# Altium schematic sheet mainMARLIN.SchDoc
size A3
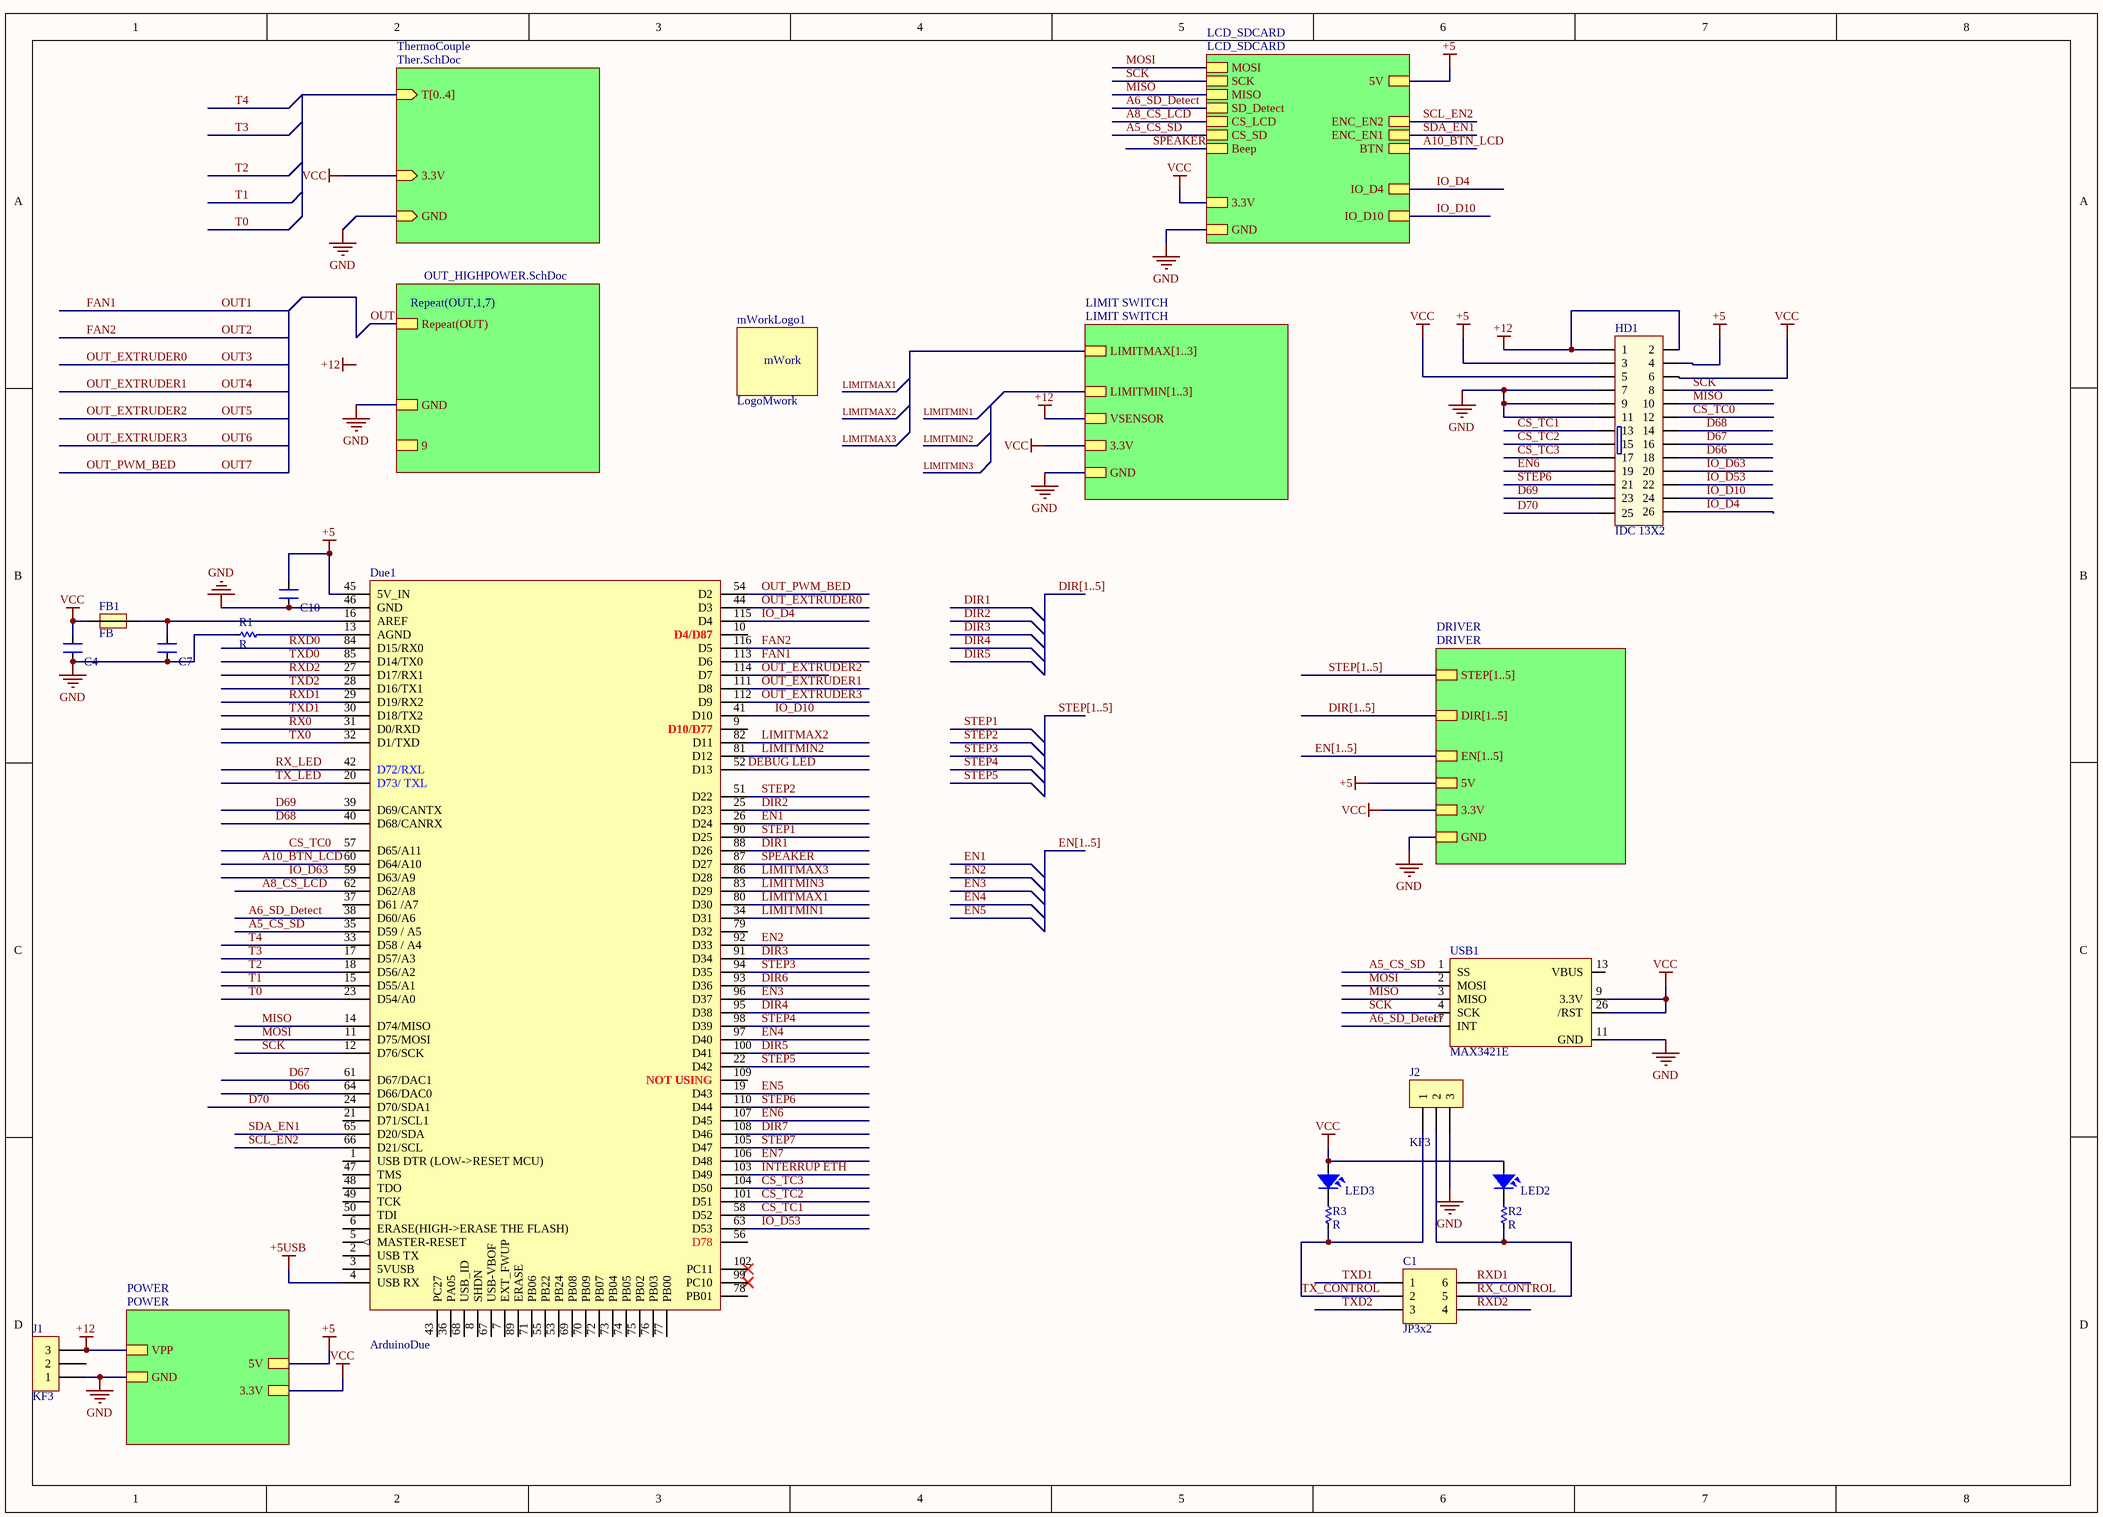
[diagram p0: mainMARLIN.SchDoc]

## Parts
C1  JP3x2  [JP3-D2T]
C4  CN  [CN-SMD-0603_big]  (value not drawn)
C7  CN  [CN-SMD-0603_big]  (value not drawn)
C10  CN  [CN-SMD-0603_big]  (value not drawn)
Due1  ArduinoDue  [DUE_MODULE_SMT]
FB1  FB  [Capacitor_805]
HD1  IDC 13X2  [IDC26-B]
J1  KF3  [KF3-5.08T]
J2  KF3  [KF3-5.08T]
LED2  LED  [LED-0805-Blue]  (value not drawn)
LED3  LED  [LED-0805-Blue]  (value not drawn)
mWorkLogo1  LogoMwork  [LogoMwork15*6]
R1  R  [RES-SMD-0603_BIG]
R2  R  [RES-SMD-0603_BIG]
R3  R  [RES-SMD-0603_BIG]
USB1  MAX3421E  [USB_SHIELD]

## Sub-sheets
DRIVER = DRIVER: STEP[1..5], DIR[1..5], EN[1..5], GND, 5V, 3.3V
LCD_SDCARD = LCD_SDCARD: MOSI, ENC_EN1, 5V, MISO, SD_Detect, CS_LCD, ENC_EN2, BTN, CS_SD, 3.3V, SCK, GND, IO_D4, IO_D10, Beep
LIMIT SWITCH = LIMIT SWITCH: LIMITMAX[1..3], LIMITMIN[1..3], 3.3V, GND, VSENSOR
POWER = POWER: VPP, 5V, GND, 3.3V
Repeat(OUT,1,7) = OUT_HIGHPOWER.SchDoc: Repeat(OUT), GND, 9
ThermoCouple = Ther.SchDoc: T[0..4] (in), 3.3V (in), GND (in)

## Nets
+5: C10.2 Due1.45(5V_IN) HD1.3 HD1.4 ; sheet POWER/5V, sheet DRIVER/5V, sheet LCD_SDCARD/5V
+5USB: Due1.4(USB_RX)
+12: HD1.1 HD1.2 J1.3 ; sheet POWER/VPP, sheet LIMIT SWITCH/VSENSOR
GND: C4.1 C7.1 C10.1 Due1.46(GND) HD1.7 HD1.9 HD1.11 J1.1 J2.3 R1.2 USB1.11(GND) ; sheet POWER/GND, sheet DRIVER/GND, sheet LIMIT SWITCH/GND, sheet ThermoCouple/GND, sheet Repeat(OUT,1,7)/GND, sheet LCD_SDCARD/GND
VCC: C4.2 FB1.1 HD1.5 HD1.6 LED2.1 LED3.1 USB1.9(3.3V) USB1.26(/RST) ; sheet POWER/3.3V, sheet DRIVER/3.3V, sheet LIMIT SWITCH/3.3V, sheet ThermoCouple/3.3V, sheet LCD_SDCARD/3.3V
A5_CS_SD: Due1.35(D59_/_A5) USB1.1(SS) ; sheet LCD_SDCARD/CS_SD
A6_SD_Detect: Due1.38(D60/A6) USB1.17(INT) ; sheet LCD_SDCARD/SD_Detect
A8_CS_LCD: Due1.62(D62/A8) ; sheet LCD_SDCARD/CS_LCD
A10_BTN_LCD: Due1.60(D64/A10) ; sheet LCD_SDCARD/BTN
CS_TC0: Due1.57(D65/A11) HD1.12
CS_TC1: Due1.58(D52) HD1.13
CS_TC2: Due1.101(D51) HD1.15
CS_TC3: Due1.104(D50) HD1.17
D66: Due1.64(D66/DAC0) HD1.18
D67: Due1.61(D67/DAC1) HD1.16
D68: Due1.40(D68/CANRX) HD1.14
D69: Due1.39(D69/CANTX) HD1.23
D70: Due1.24(D70/SDA1) HD1.25
DEBUG LED: Due1.52(D13)
DIR1: Due1.88(D26)
DIR2: Due1.25(D23)
DIR3: Due1.91(D34)
DIR4: Due1.95(D38)
DIR5: Due1.100(D41)
DIR6: Due1.93(D36)
DIR7: Due1.108(D46)
EN1: Due1.26(D24)
EN2: Due1.92(D33)
EN3: Due1.96(D37)
EN4: Due1.97(D40)
EN5: Due1.19(D43)
EN6: Due1.107(D45) HD1.19
EN7: Due1.106(D48)
FAN1: Due1.113(D6)  [also labelled OUT1]
FAN2: Due1.116(D5)  [also labelled OUT2]
INTERRUP ETH: Due1.103(D49)
IO_D4: Due1.115(D4) HD1.26 ; sheet LCD_SDCARD/IO_D4
IO_D10: Due1.41(D10) HD1.24 ; sheet LCD_SDCARD/IO_D10
IO_D53: Due1.63(D53) HD1.22
IO_D63: Due1.59(D63/A9) HD1.20
LIMITMAX1: Due1.80(D30)
LIMITMAX2: Due1.82(D11)
LIMITMAX3: Due1.86(D28)
LIMITMIN1: Due1.34(D31)
LIMITMIN2: Due1.81(D12)
LIMITMIN3: Due1.83(D29)
MISO: Due1.14(D74/MISO) HD1.10 USB1.3(MISO) ; sheet LCD_SDCARD/MISO
MOSI: Due1.11(D75/MOSI) USB1.2(MOSI) ; sheet LCD_SDCARD/MOSI
OUT: sheet Repeat(OUT,1,7)/Repeat(OUT)
OUT3: Due1.44(D3)  [also labelled OUT_EXTRUDER0]
OUT4: Due1.111(D8)  [also labelled OUT_EXTRUDER1]
OUT5: Due1.114(D7)  [also labelled OUT_EXTRUDER2]
OUT6: Due1.112(D9)  [also labelled OUT_EXTRUDER3]
OUT7: Due1.54(D2)  [also labelled OUT_PWM_BED]
RX0: Due1.31(D0/RXD)
RX_CONTROL: C1.5 J2.2 R2.1
RX_LED: Due1.42(D72/RXL)
RXD0: Due1.84(D15/RX0)
RXD1: C1.6 Due1.29(D19/RX2)
RXD2: C1.4 Due1.27(D17/RX1)
SCK: Due1.12(D76/SCK) HD1.8 USB1.4(SCK) ; sheet LCD_SDCARD/SCK
SCL_EN2: Due1.66(D21/SCL) ; sheet LCD_SDCARD/ENC_EN2
SDA_EN1: Due1.65(D20/SDA) ; sheet LCD_SDCARD/ENC_EN1
SPEAKER: Due1.87(D27) ; sheet LCD_SDCARD/Beep
STEP1: Due1.90(D25)
STEP2: Due1.51(D22)
STEP3: Due1.94(D35)
STEP4: Due1.98(D39)
STEP5: Due1.22(D42)
STEP6: Due1.110(D44) HD1.21
STEP7: Due1.105(D47)
T0: Due1.23(D54/A0)
T1: Due1.15(D55/A1)
T2: Due1.18(D56/A2)
T3: Due1.17(D57/A3)
T4: Due1.33(D58_/_A4)
TX0: Due1.32(D1/TXD)
TX_CONTROL: C1.2 J2.1 R3.1
TX_LED: Due1.20(D73/_TXL)
TXD0: Due1.85(D14/TX0)
TXD1: C1.1 Due1.30(D18/TX2)
TXD2: C1.3 Due1.28(D16/TX1)
NetC7_2: C7.2 Due1.16(AREF) FB1.2
NetDue1_13: Due1.13(AGND) R1.1
NetLED2_2: LED2.2 R2.2
NetLED3_2: LED3.2 R3.2

Not connected (* = marked no-connect by the designer): Due1 1(USB_DTR_(LOW->RESET_MCU)) 2(USB_TX) 3(5VUSB) 5(MASTER-RESET) 6(ERASE(HIGH->ERASE_THE_FLASH)) 7(EXT_FWUP) 8(SHDN) 9(D10/D77) 10(D4/D87) 21(D71/SCL1) 36(PA05) 37(D61_/A7_) 43(PC27) 47(TMS) 48(TDO) 49(TCK) 50(TDI) 53(PB24) 55(PB22) 56(D78) 67(USB-VBOF) 68(USB_ID) 69(PB08) 70(PB09) 71(PB06) 72(PB07) 73(PB04) 74(PB05) 75(PB02) 76(PB03) 77(PB00) 78(PB01) 79(D32) 89(ERASE) 99(PC10)* 102(PC11)* 109(NOT_USING); J1 2; USB1 13(VBUS)

## Buses and harness runs
bus DIR[1..5]
bus DIR[1..5] = sheet DRIVER/DIR[1..5]
bus EN[1..5]
bus EN[1..5] = sheet DRIVER/EN[1..5]
bus STEP[1..5]
bus STEP[1..5] = sheet DRIVER/STEP[1..5]

## Notes on the sheet
- Labels drawn without touching a wire or pin: +12
- (in symbol LogoMwork) mWork

## Library data of the parts
C1 = JP3x2: WR-PHD 2.54 mm Dual Socket Header; Manufacturer: W¨¹rth Elektronik eiSos GmbH; partNo: 61300621821; ComponentLink1 Description: Manufacturer; ComponentLink2 Description: Datasheet; NoPins: 06; Created Date: 29 March 2013; ComponentLink1URL: http://www.we-online.com; ComponentLink2URL: http://katalog.we-online.de/em/datasheet/6130xx21821.pdf; Created by: Karrer Zheng
C4 C7 C10 = CN: Value: 33pF
HD1 = IDC 13X2: Value: Header 5x2
J1 J2 = KF3: Manufacturer: Würth Elektronik eiSos GmbH; partNo: 691103110003; ComponentLink1 Description: Manufacturer; ComponentLink2 Description: Datasheet; NoPins: 3; Created Date: 29 October 2013; ComponentLink1URL: http://www.we-online.com; ComponentLink2URL: http://katalog.we-online.de/em/datasheet/6911031100xx.pdf; Created by: Karrer Zheng
LED2 LED3 = LED SMD: Value: LED 3 - 5 ly 2 Colour
USB1 = USB_Shield_MAX3421E
Due1 = ArduinoDue: ComponentLink1Description: Buy; ComponentLink1URL: http://www.inhaos.com/product_info.php?products_id=164